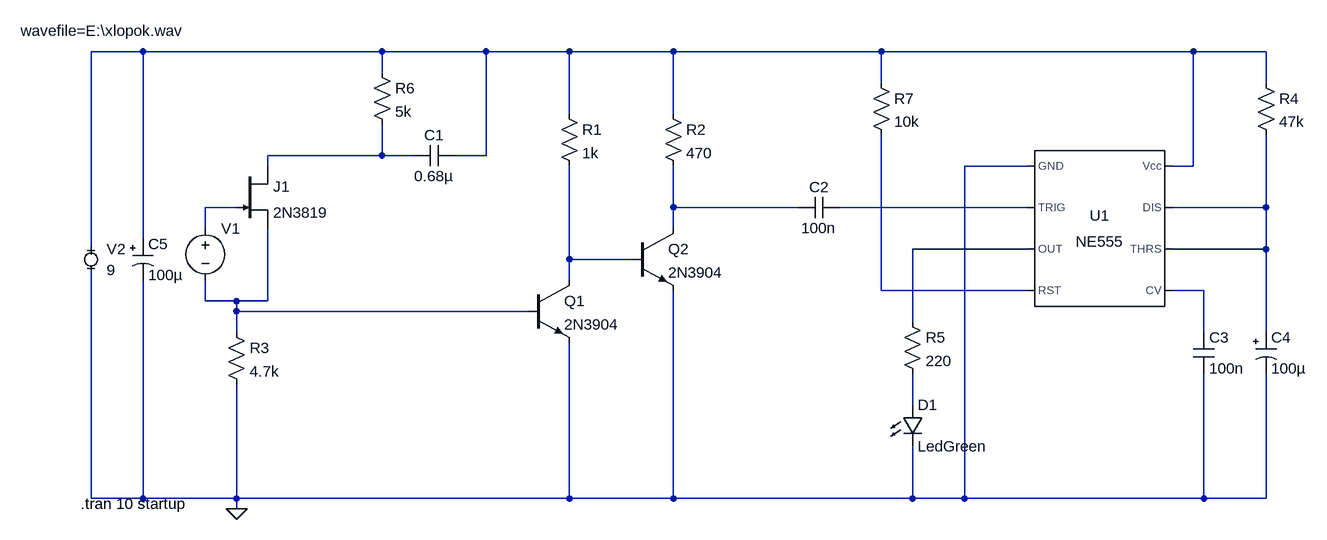
[diagram p0: schematic kyrsa4_1.asc]
kyrsa4_1.asc, the LTspice schematic file:
Version 4
SHEET 1 1620 692
WIRE -176 -48 -256 -48
WIRE 192 -48 -176 -48
WIRE 352 -48 192 -48
WIRE 480 -48 352 -48
WIRE 640 -48 480 -48
WIRE 960 -48 640 -48
WIRE 1440 -48 960 -48
WIRE 1552 -48 1440 -48
WIRE 192 -16 192 -48
WIRE 960 0 960 -48
WIRE 1552 0 1552 -48
WIRE 480 48 480 -48
WIRE 640 48 640 -48
WIRE 192 112 192 64
WIRE 192 112 16 112
WIRE 240 112 192 112
WIRE 352 112 352 -48
WIRE 352 112 304 112
WIRE 16 128 16 112
WIRE 1184 128 1088 128
WIRE 1440 128 1440 -48
WIRE 1440 128 1408 128
WIRE -32 192 -80 192
WIRE 640 192 640 128
WIRE 832 192 640 192
WIRE 1184 192 896 192
WIRE 1552 192 1552 80
WIRE 1552 192 1408 192
WIRE -80 224 -80 192
WIRE 640 224 640 192
WIRE -176 240 -176 -48
WIRE -256 256 -256 -48
WIRE 1184 256 1008 256
WIRE 1552 256 1552 192
WIRE 1552 256 1408 256
WIRE 480 272 480 128
WIRE 576 272 480 272
WIRE 480 304 480 272
WIRE 960 320 960 80
WIRE 1184 320 960 320
WIRE 1456 320 1408 320
WIRE -80 336 -80 304
WIRE -32 336 -80 336
WIRE 16 336 16 224
WIRE 16 336 -32 336
WIRE -32 352 -32 336
WIRE 416 352 -32 352
WIRE 1008 368 1008 256
WIRE -32 384 -32 352
WIRE 1456 384 1456 320
WIRE 1552 384 1552 256
WIRE 1008 496 1008 448
WIRE -256 640 -256 288
WIRE -176 640 -176 304
WIRE -176 640 -256 640
WIRE -32 640 -32 464
WIRE -32 640 -176 640
WIRE 480 640 480 400
WIRE 480 640 -32 640
WIRE 640 640 640 320
WIRE 640 640 480 640
WIRE 1008 640 1008 560
WIRE 1008 640 640 640
WIRE 1088 640 1088 128
WIRE 1088 640 1008 640
WIRE 1456 640 1456 448
WIRE 1456 640 1088 640
WIRE 1552 640 1552 448
WIRE 1552 640 1456 640
WIRE -32 656 -32 640
FLAG -32 656 0
SYMBOL voltage -80 208 R0
WINDOW 3 -284 -288 Left 2
SYMATTR Value wavefile=E:\xlopok.wav
SYMATTR InstName V1
SYMBOL cap 304 96 R90
WINDOW 0 0 32 VBottom 2
WINDOW 3 32 32 VTop 2
SYMATTR InstName C1
SYMATTR Value 0.68µ
SYMBOL njf -32 128 R0
SYMATTR InstName J1
SYMATTR Value 2N3819
SYMBOL MiniSyms4\\voltage- -256 272 R0
WINDOW 123 0 0 Left 2
WINDOW 39 0 0 Left 2
SYMATTR InstName V2
SYMATTR Value 9
SYMBOL res 464 32 R0
SYMATTR InstName R1
SYMATTR Value 1k
SYMBOL res 624 32 R0
SYMATTR InstName R2
SYMATTR Value 470
SYMBOL npn 416 304 R0
SYMATTR InstName Q1
SYMATTR Value 2N3904
SYMBOL npn 576 224 R0
SYMATTR InstName Q2
SYMATTR Value 2N3904
SYMBOL Misc\\NE555 1296 224 R0
SYMATTR InstName U1
SYMBOL cap 1440 384 R0
SYMATTR InstName C3
SYMATTR Value 100n
SYMBOL polcap 1536 384 R0
WINDOW 3 24 56 Left 2
SYMATTR Value 100µ
SYMATTR InstName C4
SYMATTR Description Capacitor
SYMATTR Type cap
SYMATTR SpiceLine V=10 Irms=210m Rser=0.55 Lser=0
SYMBOL res 1536 -16 R0
SYMATTR InstName R4
SYMATTR Value 47k
SYMBOL res 992 352 R0
SYMATTR InstName R5
SYMATTR Value 220
SYMBOL LED 992 496 R0
SYMATTR InstName D1
SYMATTR Value LedGreen
SYMATTR Description Diode
SYMATTR Type diode
SYMBOL res 176 -32 R0
SYMATTR InstName R6
SYMATTR Value 5k
SYMBOL cap 896 176 R90
WINDOW 0 0 32 VBottom 2
WINDOW 3 32 32 VTop 2
SYMATTR InstName C2
SYMATTR Value 100n
SYMBOL res -48 368 R0
SYMATTR InstName R3
SYMATTR Value 4.7k
SYMBOL res 944 -16 R0
SYMATTR InstName R7
SYMATTR Value 10k
SYMBOL polcap -192 240 R0
WINDOW 3 24 56 Left 2
SYMATTR Value 100µ
SYMATTR InstName C5
SYMATTR Description Capacitor
SYMATTR Type cap
SYMATTR SpiceLine V=10 Irms=235m Rser=0.46 Lser=0 mfg="Panasonic" pn="ECA1AFQ101" type="Al electrolytic"
TEXT -272 648 Left 2 !.tran 10 startup

The netlist it stands for:
* kyrsa4_1.asc
V1 N003 N011 wavefile=E:\xlopok.wav
C1 N001 N002 0.68µ
J1 N002 N003 N011 2N3819
V2 N001 0 9
R1 N001 N008 1k
R2 N001 N004 470
Q1 N008 N011 0 0 2N3904
Q2 N004 N008 0 0 2N3904
XU1 0 N005 N007 N009 N010 N006 N006 N001 NE555  ; pins GND TRIG OUT RST CV THRS DIS Vcc
C3 N010 0 100n
C4 N006 0 100µ V=10 Irms=210m Rser=0.55 Lser=0
R4 N001 N006 47k
R5 N007 N012 220
D1 N012 0 LedGreen
R6 N001 N002 5k
C2 N005 N004 100n
R3 N011 0 4.7k
R7 N001 N009 10k
C5 N001 0 100µ V=10 Irms=235m Rser=0.46 Lser=0 mfg="Panasonic" pn="ECA1AFQ101" type="Al electrolytic"
.model D D
.lib standard.dio
.model NPN NPN
.model PNP PNP
.lib standard.bjt
.model NJF NJF
.model PJF PJF
.lib standard.jft
.tran 10 startup
.lib NE555.sub
.backanno
.end